# EAGLE design circuit-main (EAGLE 7.5.0)
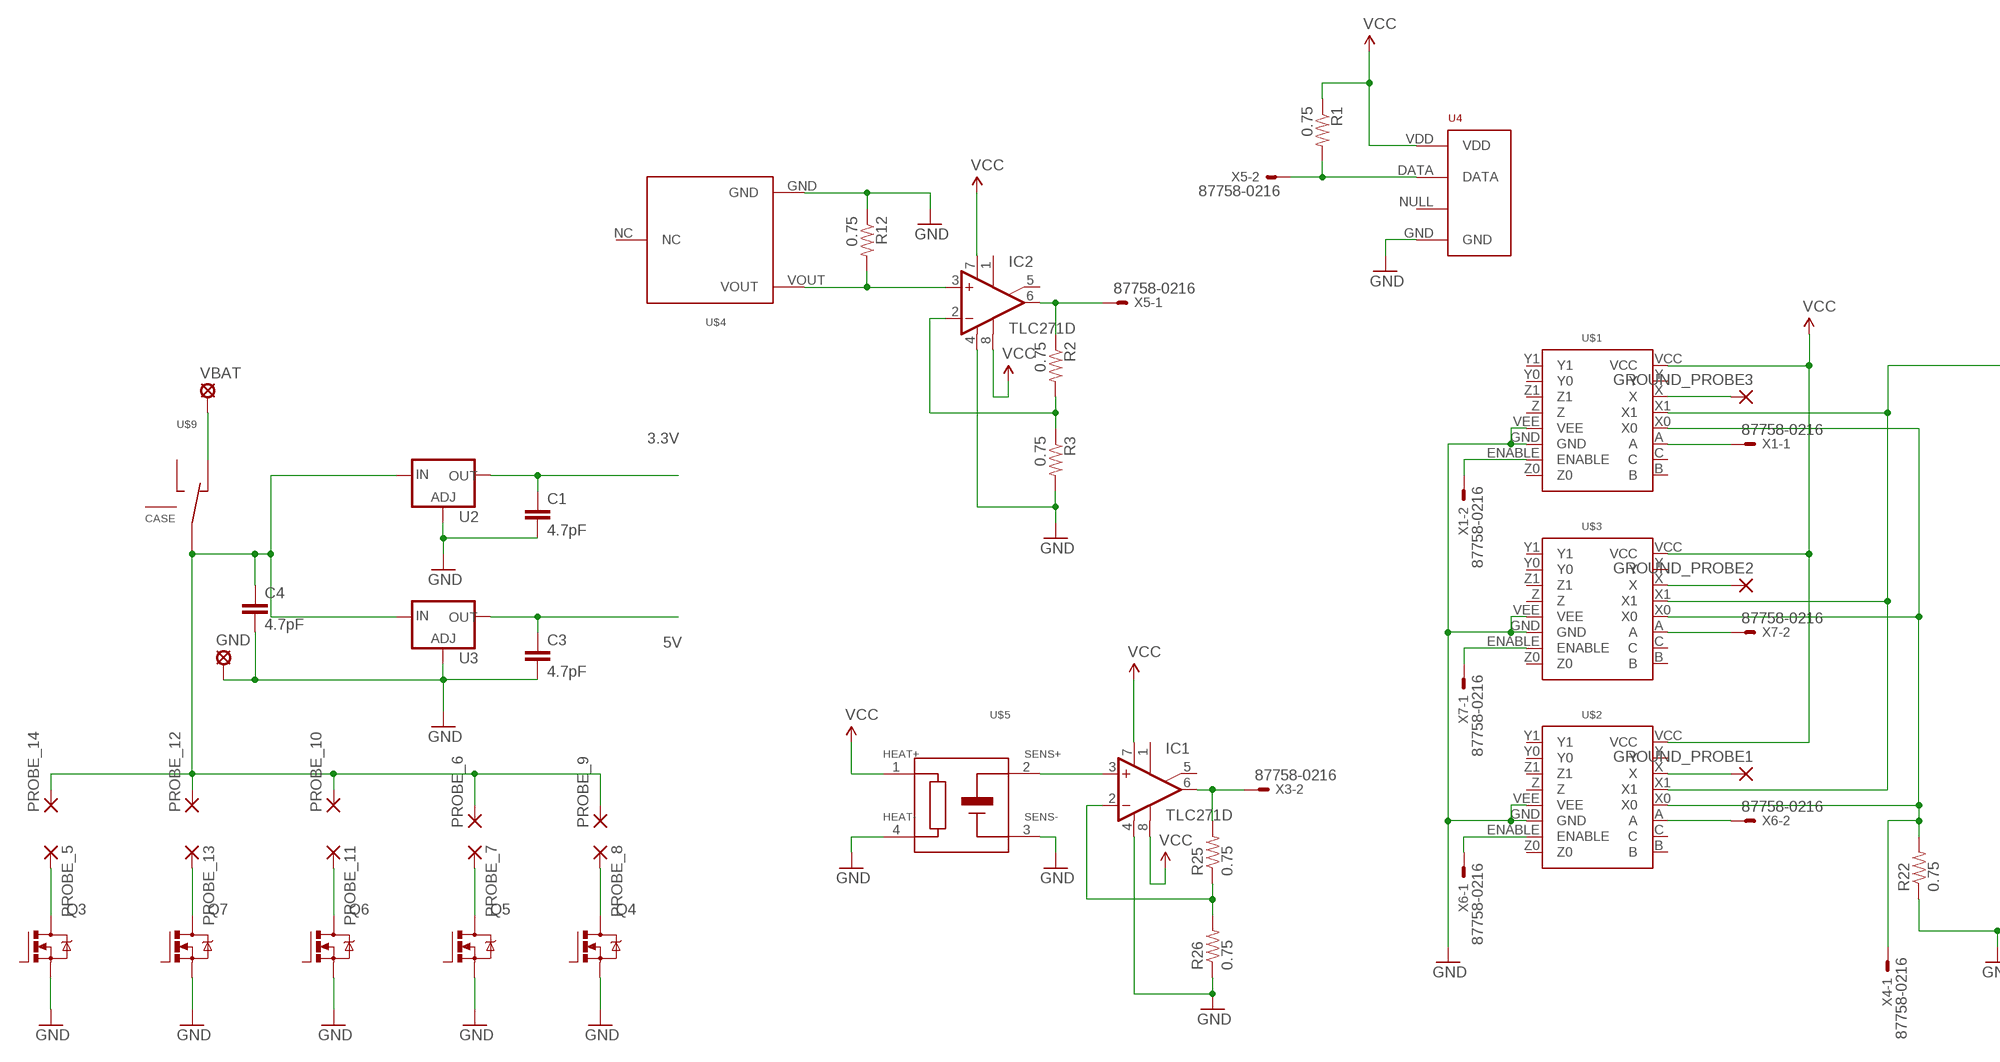
[diagram p0: schematic, sheet 1, part 1 of 2]
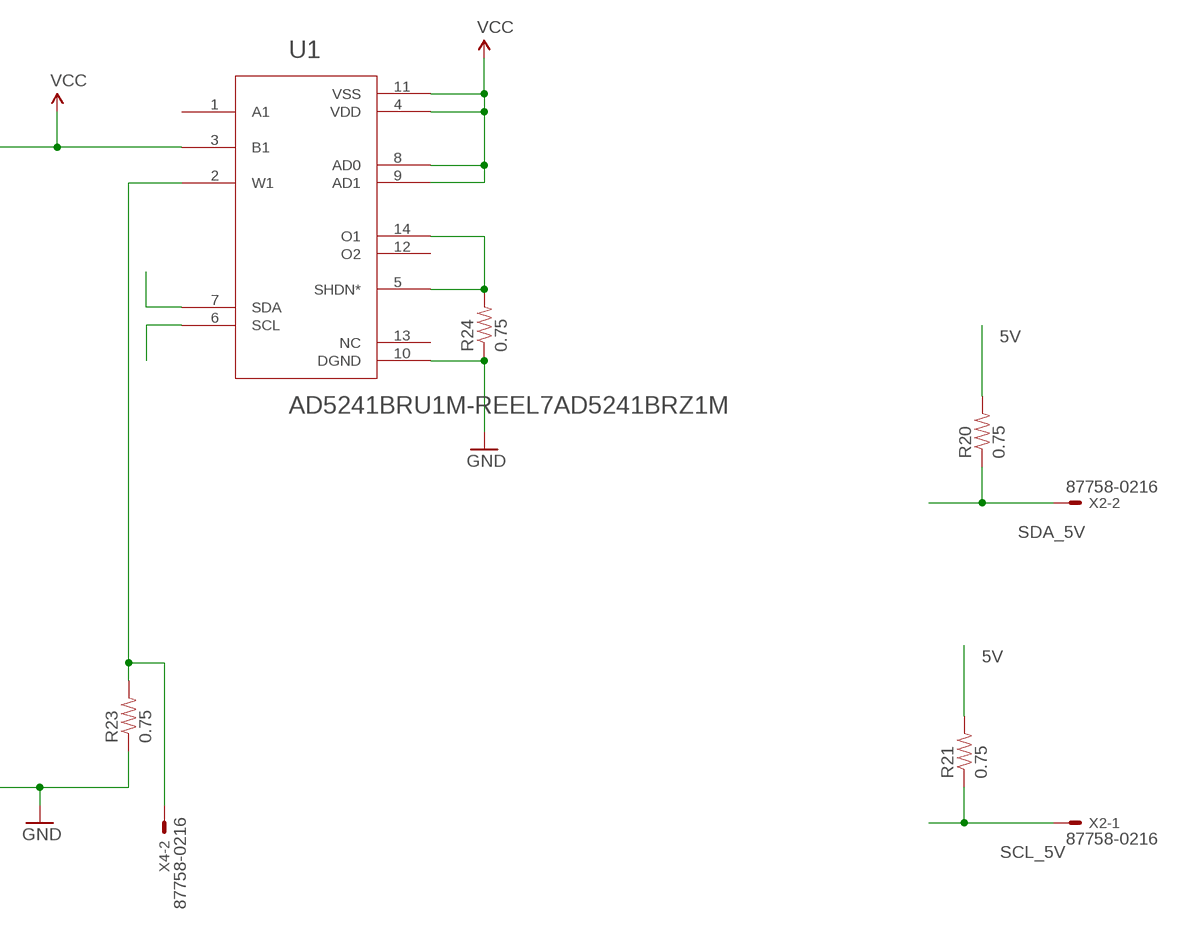
[diagram p1: schematic, sheet 1, part 2 of 2]

## Parts
C1  4.7pF  4.7PF-50V(-/+.25PF)(0603)  [0603-CAP]
C3  4.7pF  4.7PF-50V(-/+.25PF)(0603)  [0603-CAP]
C4  4.7pF  4.7PF-50V(-/+.25PF)(0603)  [0603-CAP]
GND  LSP10  [LSP10]
GROUND_PROBE1  2,54/0,8  [2,54/0,8]
GROUND_PROBE2  2,54/0,8  [2,54/0,8]
GROUND_PROBE3  2,54/0,8  [2,54/0,8]
IC1  TLC271D  [SO08]
IC2  TLC271D  [SO08]
PROBE_5  2,54/0,8  [2,54/0,8]
PROBE_6  2,54/0,8  [2,54/0,8]
PROBE_7  2,54/0,8  [2,54/0,8]
PROBE_8  2,54/0,8  [2,54/0,8]
PROBE_9  2,54/0,8  [2,54/0,8]
PROBE_10  2,54/0,8  [2,54/0,8]
PROBE_11  2,54/0,8  [2,54/0,8]
PROBE_12  2,54/0,8  [2,54/0,8]
PROBE_13  2,54/0,8  [2,54/0,8]
PROBE_14  2,54/0,8  [2,54/0,8]
Q3  NTR4501N  [SOT-23]
Q4  NTR4501N  [SOT-23]
Q5  NTR4501N  [SOT-23]
Q6  NTR4501N  [SOT-23]
Q7  NTR4501N  [SOT-23]
R1  0.75  0.75OHM-1/4W-1%(0805)  [0805]
R2  0.75  0.75OHM-1/4W-1%(0805)  [0805]
R3  0.75  0.75OHM-1/4W-1%(0805)  [0805]
R12  0.75  0.75OHM-1/4W-1%(0805)  [0805]
R20  0.75  0.75OHM-1/4W-1%(0805)  [0805]
R21  0.75  0.75OHM-1/4W-1%(0805)  [0805]
R22  0.75  0.75OHM-1/4W-1%(0805)  [0805]
R23  0.75  0.75OHM-1/4W-1%(0805)  [0805]
R24  0.75  0.75OHM-1/4W-1%(0805)  [0805]
R25  0.75  0.75OHM-1/4W-1%(0805)  [0805]
R26  0.75  0.75OHM-1/4W-1%(0805)  [0805]
U1  AD5241BRU1M-REEL7AD5241BRZ1M  [SOIC-14]
U2  TLV1117-33  [SOT223]
U3  LD1117S50  [SOT223]
U4  RHT03_DHT-22_AM2302RA  [RHT03_DHT-22/RA]
U$1  MC74HC4051A  [SOIC16]
U$2  MC74HC4051A  [SOIC16]
U$3  MC74HC4051A  [SOIC16]
U$4  O2-A2  [O2-A2]
U$5  TGS4161  [TGS4161]
U$9  SS-8  [SS-8]
VBAT  LSP10  [LSP10]
X1  87758-0216  [87758-0216]
X2  87758-0216  [87758-0216]
X3  87758-0216  [87758-0216]
X4  87758-0216  [87758-0216]
X5  87758-0216  [87758-0216]
X6  87758-0216  [87758-0216]
X7  87758-0216  [87758-0216]

## Nets
3.3V: C1.1 R1.1 U2.2(OUT) U2.4(OUT) U4.VDD ; supply symbol labelled VCC
5V: C3.1 IC1.7(V+) IC1.8(OPT) IC2.7(V+) IC2.8(OPT) R20.2 R21.2 U1.3(B1) U1.4(VDD) U1.8(AD0) U1.9(AD1) U1.11(VSS) U3.2(OUT) U3.4(OUT) U$1.VCC U$1.X1 U$2.VCC U$2.X1 U$3.VCC U$3.X1 U$5.1(HEAT+) ; supply symbol labelled VCC
GND: C1.2 C3.2 C4.2 GND.MP IC1.4(V-) IC2.4(V-) Q3.2(S) Q4.2(S) Q5.2(S) Q6.2(S) Q7.2(S) R3.2 R12.1 R22.1 R23.1 R24.1 R26.1 U1.10(DGND) U2.1(ADJ) U3.1(ADJ) U4.GND U$1.GND U$1.VEE U$2.GND U$2.VEE U$3.GND U$3.VEE U$4.GND U$5.3(SENS-) U$5.4(HEAT-)
N$1: IC2.6(OUT) R2.1 X5.1
N$2: GROUND_PROBE3.1(P) U$1.X
N$3: R1.2 U4.DATA X5.2
N$4: IC2.2(-IN) R2.2 R3.1
N$5: GROUND_PROBE2.1(P) U$3.X
N$6: GROUND_PROBE1.1(P) U$2.X
N$8: R23.2 U1.2(W1) X4.2
N$9: R22.2 U$1.X0 U$2.X0 U$3.X0 X4.1
N$11: U$3.ENABLE X7.1
N$12: U$3.A X7.2
N$13: U$2.A X6.2
N$14: U$1.A X1.1
N$15: U$1.ENABLE X1.2
N$16: U$2.ENABLE X6.1
N$18: PROBE_5.1(P) Q3.3(D)
N$19: R24.2 U1.5(SHDN*) U1.14(O1)
N$22: IC1.3(+IN) U$5.2(SENS+)
N$23: PROBE_8.1(P) Q4.3(D)
N$24: IC1.6(OUT) R25.2 X3.2
N$27: PROBE_7.1(P) Q5.3(D)
N$29: PROBE_11.1(P) Q6.3(D)
N$30: PROBE_13.1(P) Q7.3(D)
N$33: U$9.P2 VBAT.MP
N$110: IC2.3(+IN) R12.2 U$4.VOUT
N$111: IC1.2(-IN) R25.1 R26.2
SCL_5V: R21.1 U1.6(SCL) X2.1
SDA_5V: R20.1 U1.7(SDA) X2.2
VBAT: C4.1 PROBE_6.1(P) PROBE_9.1(P) PROBE_10.1(P) PROBE_12.1(P) PROBE_14.1(P) U2.3(IN) U3.3(IN) U$9.COM
Unconnected: IC1.1(ON1) IC1.5(ON2) IC2.1(ON1) IC2.5(ON2) Q3.1(G) Q4.1(G) Q5.1(G) Q6.1(G) Q7.1(G) U1.1(A1) U1.12(O2) U1.13(NC) U4.NULL U$1.B U$1.C U$1.Y U$1.Y0 U$1.Y1 U$1.Z U$1.Z0 U$1.Z1 U$2.B U$2.C U$2.Y U$2.Y0 U$2.Y1 U$2.Z U$2.Z0 U$2.Z1 U$3.B U$3.C U$3.Y U$3.Y0 U$3.Y1 U$3.Z U$3.Z0 U$3.Z1 U$4.NC U$9.CASE_L(CASE) U$9.CASE_R(CASE) U$9.P1 X3.1

## Library data of the parts
C1 C3 C4 = SparkFun-Capacitors:4.7PF-50V(-/+.25PF)(0603): CAP-07880; PROD_ID: CAP-07880
GND VBAT = solpad:LSP10: SOLDER PAD drill 1.0 mm, distributor Buerklin, 12H555
GROUND_PROBE1-GROUND_PROBE3 PROBE_5-PROBE_14 = wirepad:2,54/0,8: THROUGH-HOLE PAD
IC1 IC2 = linear:TLC271: OP AMP
Q3-Q7 = elements:NTR4501N: NTR4501N, NVR4501N Power MOSFET 20 V, 3.2 A, Single N−Channel, SOT−23 http://www.onsemi.ru.com/pub_link/Collateral/NTR4501N-D.PDF
R1-R3 R12 R20-R26 = SparkFun-Resistors:0.75OHM-1/4W-1%(0805): RES-08474; PROD_ID: RES-08474
U1 = elements:AD5241BRU1M-REEL7
U2 = elements:TLV1117-33: Voltage Regulator LM1117 Standard adjustable voltage regulator but in SMD form. Spark Fun Electronics SKU : COM-00595
U3 = elements:LD1117S50: Voltage Regulator LM1117 Standard adjustable voltage regulator but in SMD form. Spark Fun Electronics SKU : COM-00595
U4 = RHT03_DHT-22_AM2302:RHT03_DHT-22_AM2302: RHT03 / DHT-22 / AM2302 Packages and symbol for the RHT03 / DHT-22 relative humidity and temperature sensor. Note: The AM2302 is a wired version of the DHT-22 which typically requires less clearance and is thus provided as a separate package.; PROD_ID: SEN-10167
U$1-U$3 = elements:MC74HC4051A
U$4 = datchiki:O2-A2: O2-A2 Oxy O2-A2 Oxygen Sensor en Sensor http://www.alphasense.com/WEB1213/wp-content/uploads/2015/09/O2A2.pdf
U$5 = datchiki:TGS4161: TGS4161 The Figaro TGS4161 is a new solid electrolyte type sensor which offers miniaturization, low power consumption, and long life. The TGS4161 displays high selectivity to carbon dioxide. Also, the TGS4161 displays good long term stability and shows excellent durability against the effects of high humidity through the application of innovative technology in the sensor’s electrode design. http://www.netzmafia.de/skripten/hardware/Datenblaetter/Gassensoren/TGS4161Dtl.pdf
U$9 = elements:SS-8: SS-8 Наименование: Переключатель мини 3 конт. прям. уг.тип 8 Производитель: Тайвань (Китай) http://www.brownbear.ru/components/ss-8.html
X1-X7 = con-molex:87758-0216: 2 Pin - 2mm Dual Row Single Wafer, Vertical T/H HDR Source: http://www.molex.com/pdm_docs/sd/877580616_sd.pdf; MPN: 87758-0216; OC_FARNELL: unknown; OC_NEWARK: 94M1513

## Board
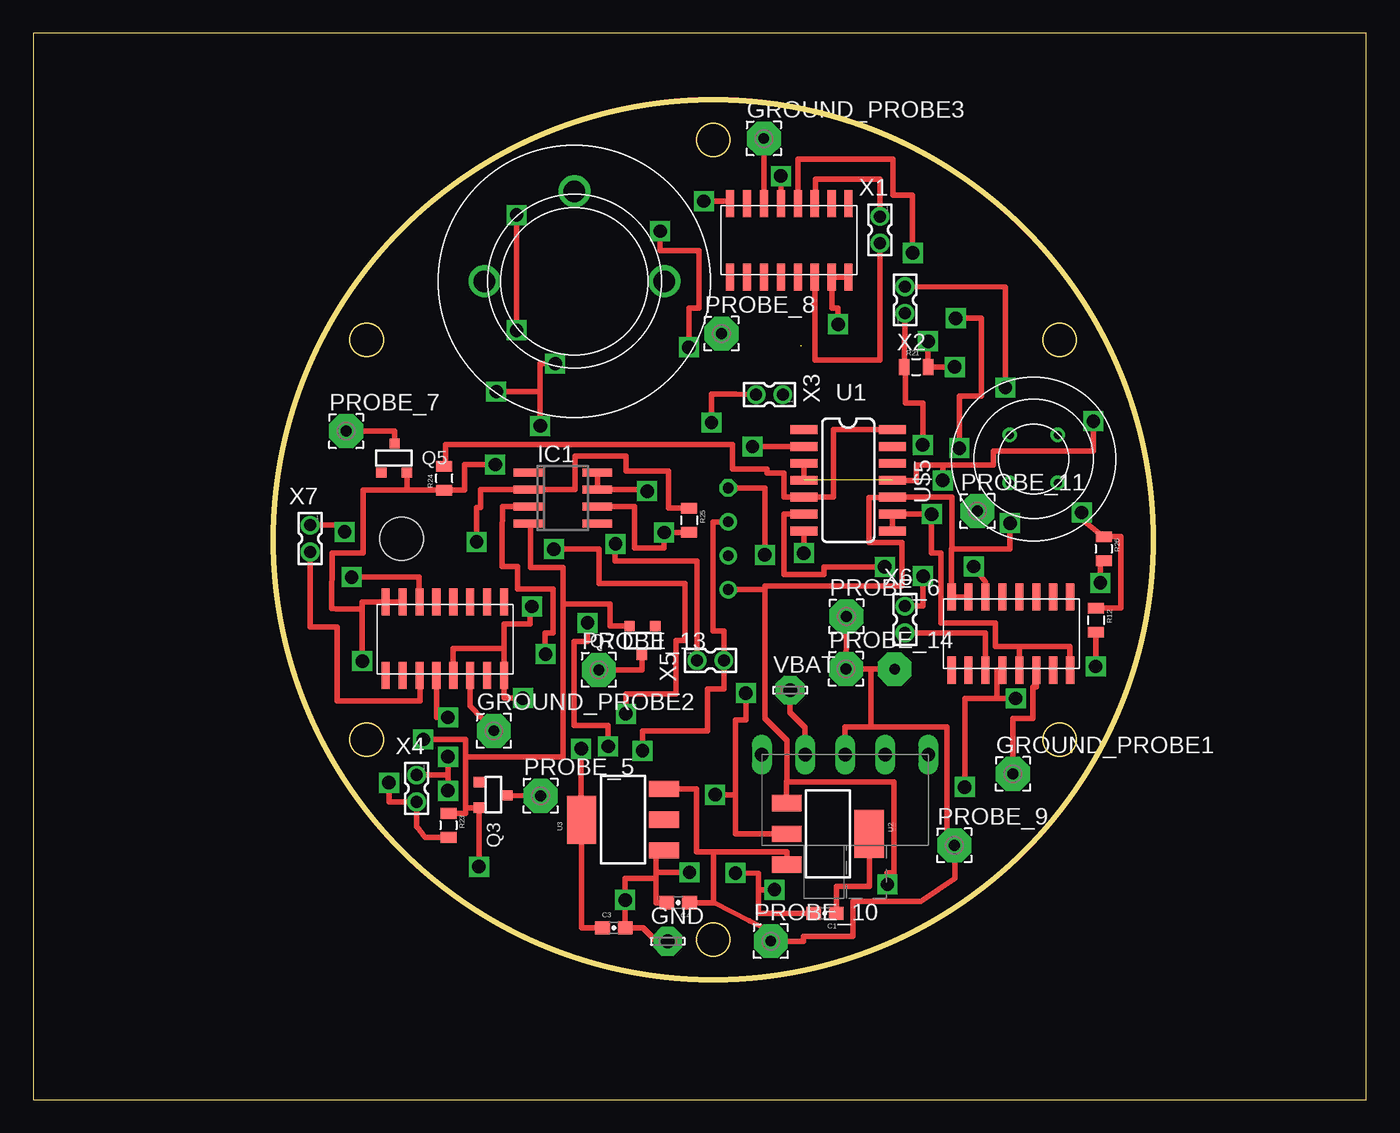
[diagram p2: board, top side]
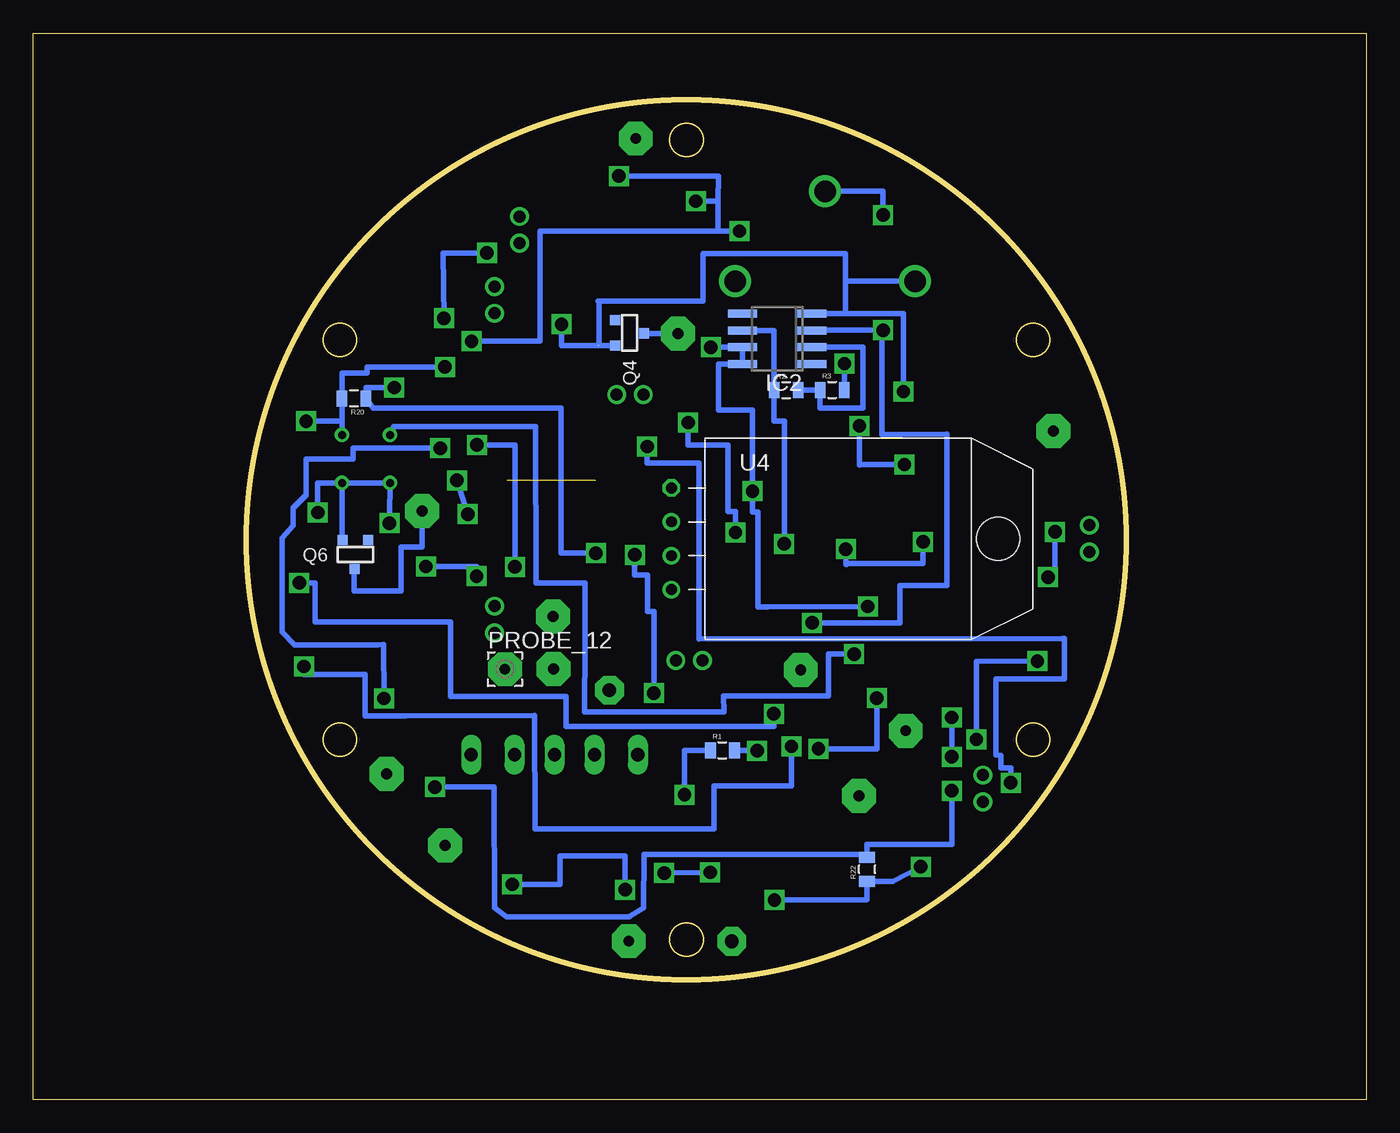
[diagram p3: board, bottom side, seen from below]

Size 100 x 80 mm. Coordinates in mm from the lower left corner, seen from the top.
Outline: 0,0 100,0 100,80 0,80 0,0
Outline: circle at 51,42 radius 33
Outline: circle at 25,27 radius 1.25
Outline: circle at 77,27 radius 1.25
Outline: circle at 51,72 radius 1.25
Outline: circle at 25,57 radius 1.25
Outline: circle at 77,57 radius 1.25
Outline: circle at 51,12 radius 1.25
Copper layers (1*16): Top 0.035mm / dielectric 1.5mm / Bottom 0.035mm
Design rules "default": minimum track width 10mil, minimum drill 24mil, track to track 8mil, track to pad 8mil, pad to pad 8mil, via to via 8mil, smd to smd 8mil, copper to edge 40mil, drill to drill 8mil, minimum pad ring 10mil, minimum via ring 8mil, stop-mask expansion 4mil, vias tented up to drill 0mil, thermal gap 10mil

### Footprints (pad centres in the part's own frame; a part is rotated, then mirrored left to right if it is on the bottom)
0603-CAP = smd 1.1 x 1: 1 -0.85,0; 2 0.85,0
LSP10 = drill 1.016 pad 2.159 octagon: MP 0,0
2,54/0,8 = drill 0.813 pad 2.54 octagon: 1 0,0
SO08 = smd 0.6 x 2.2: 1 -1.905,-2.6; 2 -0.635,-2.6; 3 0.635,-2.6; 4 1.905,-2.6; 5 1.905,2.6; 6 0.635,2.6; 7 -0.635,2.6; 8 -1.905,2.6
SOT-23 = smd 0.762 x 0.762: 1 -0.979,-1.101; 2 0.94,-1.101; 3 0.025,1.067
0805 = smd 0.8 x 1.2: 1 -0.9,0; 2 0.9,0
SOIC-14 = smd 0.66 x 2.032: 1 -4.445,-3.315; 2 -3.175,-3.315; 3 -1.905,-3.315; 4 -0.635,-3.315; 5 0.635,-3.315; 6 1.905,-3.315; 7 3.175,-3.315; 8 3.175,3.315; 9 1.905,3.315; 10 0.635,3.315; 11 -0.635,3.315; 12 -1.905,3.315; 13 -3.175,3.315; 14 -4.445,3.315
SOT223 = smd 1.219 x 2.235: 1 -2.311,-3.099; 2 0,-3.099; 3 2.311,-3.099 | smd 3.6 x 2.2: 4 0,3.099
RHT03_DHT-22/RA = drill 0.8: DATA -1.27,0; GND 3.81,0; NULL 1.27,0 | drill 0.8 octagon: VDD -3.81,0 | hole 3.25: 0,24.5
SOIC16 = smd 2.03 x 0.61: A 5.33,3.17; B 5.33,1.9; C 5.33,0.63; ENABLE -0.17,3.17; GND -0.17,0.63; VCC 5.33,9.52; VEE -0.17,1.9; X 5.33,6.98; X0 5.33,4.44; X1 5.33,5.71; Y 5.33,8.25; Y0 -0.17,8.25; Y1 -0.17,9.52; Z -0.17,5.71; Z0 -0.17,4.44; Z1 -0.17,6.98
O2-A2 = drill 1.6: GND 6.75,0; NC -6.75,0; VOUT 0,-6.75
TGS4161 = drill 0.6: 1 1.8,-1.8; 2 1.8,1.8; 3 -1.8,1.8; 4 -1.8,-1.8
SS-8 = drill 1 long: CASE_L -6.25,-3.81; CASE_R 6.25,-3.81; COM 0,-3.81; P1 -3,-3.81; P2 3,-3.81
87758-0216 = drill 0.9 pad 1.27: 1 0,-1; 2 0,1

### Placement (x,y rotation side)
C1  59.39,13.97 180 top
C3  43.55,12.88 0 top
C4  48.38,14.77 180 top
GND  47.59,11.87 0 top
GROUND_PROBE1  73.5,24.43 0 top
GROUND_PROBE2  34.55,27.67 0 top
GROUND_PROBE3  54.8,72.11 0 top
IC1  39.72,45.12 270 top
IC2  44.2,57.08 90 bottom
PROBE_5  38.05,22.79 0 top
PROBE_6  61.01,36.24 0 top
PROBE_7  23.47,50.15 0 top
PROBE_8  51.63,57.47 0 top
PROBE_9  69.1,19.07 0 top
PROBE_10  55.33,11.88 0 top
PROBE_11  70.84,44.15 0 top
PROBE_12  64.62,32.29 0 bottom
PROBE_13  42.42,32.24 0 top
PROBE_14  60.97,32.31 0 top
Q3  34.52,22.84 270 top
Q4  55.25,57.51 270 bottom
Q5  27.09,48.15 0 top
Q6  75.86,40.88 180 bottom
Q7  45.68,34.42 180 top
R1  48.3,26.2 0 bottom
R2  43.52,53.23 0 bottom
R3  40.08,53.25 0 bottom
R12  79.72,35.98 270 top
R20  75.95,52.6 180 bottom
R21  66.22,54.98 0 top
R22  37.45,17.27 90 bottom
R23  31.14,20.57 270 top
R24  30.82,46.62 90 top
R25  49.2,43.48 270 top
R26  80.3,41.33 270 top
U1  61.15,45.83 270 top
U2  59.62,19.93 270 top
U3  44.23,21 90 top
U4  52.12,42.08 270 bottom
U$1  61.8,61.88 90 top
U$2  68.27,37.55 270 top
U$3  25.8,37.15 270 top
U$4  40.59,61.4 180 top
U$5  75.05,48.07 90 top
U$9  60.9,22.07 180 top
VBAT  56.77,30.72 0 top
X1  63.52,65.25 180 top
X2  65.4,59.99 0 top
X3  55.23,52.9 90 top
X4  28.76,23.34 180 top
X5  50.8,32.95 270 top
X6  65.39,36.02 180 top
X7  20.77,42.09 180 top

### Tracks (layer width: path | path; a pad name or v marks a point on that pad's centre or on a via)
3.3V  (via drill 1)
  Top 0.406: 61.83,20.61 U2.4 62.72,16 60.24,16 C1.1 | U2.2 52.67,19.93 52.67,22.85 | v51.15,22.88 52.67,22.85 | 52.67,22.85 52.67,28.48 53.45,28.48 v53.45,30.5 | U4.VDD 54.88,45.88 v54.88,40.88
  Bottom 0.406: R1.1 51.15,26.2 v51.15,22.88 | v53.45,30.5 53.45,36.62 53.92,36.62 53.92,39.38 54.9,39.38 54.9,40.88 v54.88,40.88
5V  (via drill 1)  (1 unrouted)
  Top 0.406: U1.3 U1.4 | U1.8 U1.9 v67.4,43.92 67.38,43.92 67.38,41 68.08,41 68.08,35.75 72.17,35.75 72.17,34 73.97,34 | 56.08,67.21 U$1.X1 | U$1.X1 | 52.25,67.21 U$1.VCC 52.11,67.38 arc90 52.09,67.4 v50.3,67.4 | v56.08,69.3 56.09,68.92 U$1.X1 | v69.12,54.98 R21.2 v67.12,56.9 | U$2.X1 73.97,34 | 73.97,34 77.75,34 77.75,32.22 U$2.VCC | IC1.8 IC1.7 46.05,45.76 v46.05,45.65 | v37.4,37 37.27,36.83 37.27,35.7 35.3,35.7 35.3,33.85 | U$3.X1 31.51,33.85 35.3,33.85 | 35.3,33.85 35.3,33.15 35.33,33.15 U$3.VCC 35.32,30.12 v36.73,30.12 | v41.1,26.32 41.1,21 U3.4 41.13,12.88 C3.1 | v79.53,50.9 79.53,48.65 72.03,48.65 72.03,47.62 68.22,47.62 | U1.11 66.25,46.45 66.25,47.62 68.22,47.62 | v68.22,46.45 68.22,47.62 | v49.17,56.45 49.17,59.4 49.95,59.4 49.95,63.7 47.02,63.7 v47.02,65.15
  Bottom 0.406: v56.08,69.3 48.6,69.3 48.61,67.43 48.64,67.4 | U$5.1 76.85,50.9 | 76.85,50.9 R20.2 76.85,54.52 74.97,54.52 74.97,54.98 v69.12,54.98 | v67.12,56.9 62,56.9 62,65.15 48.62,65.15 | v50.3,67.4 48.64,67.4 | IC2.8 IC2.7 v49.17,56.44 v49.17,56.45 | v37.4,37 44.92,36.98 45.65,36.95 45.65,44.08 46.05,44.08 v46.05,45.65 46.05,51.73 48.6,51.73 48.6,55.17 IC2.8 | v36.73,30.12 36.73,26.32 v41.1,26.32 | 46.85,55.17 IC2.8 | v79.53,50.9 76.85,50.9 | v67.4,43.92 v68.22,46.45 | v47.02,65.15 48.62,65.15 | 48.64,67.4 48.62,67.4 48.62,65.15
GND  (via drill 1)  (1 unrouted)
  Top 0.406: U$2.VEE U$2.GND 68.89,41.33 68.9,41.33 | U$3.VEE U$3.GND 24.68,37.34 24.68,36.82 | U$1.GND U$1.VEE | GND.MP 46.77,11.88 45.75,12.9 44.42,12.9 C3.2 v44.4,14.97 44.4,16.6 46.73,16.6 | 46.73,16.6 46.73,17.05 | 46.73,17.05 46.73,18.69 U3.1 | C4.2 46.73,14.78 46.73,16.6 | v78.65,44.05 78.65,43.52 R26.1 80.33,42.25 81.6,42.25 81.6,36.88 R12.1 | v49.23,17.05 46.73,17.05 | 32.42,21.88 33.42,21.88 Q3.2 33.42,21.8 v33.42,17.48 | 32.42,25.73 32.42,21.88 | C1.2 58.52,13.97 54.4,13.97 54.4,15.75 | v52.67,17 54.4,16.98 54.4,15.75 | 56.5,23.82 64.58,23.82 64.58,17.02 64.05,17.02 64.05,16.15 v64.08,16.15 | 56.5,23.82 56.5,22.87 U2.1 | 54.4,15.75 v55.6,15.75 | 32.42,25.73 39.75,25.73 39.75,37.17 | 59.85,61.71 U$1.VEE | Q5.2 28.03,45.75 | 28.03,45.75 R24.1 32.35,45.73 32.35,47.65 v34.65,47.65 | v73.28,43.25 73.28,41.33 68.9,41.33 | 68.9,41.33 68.9,45.2 U1.10 64.46,45.17 62.7,45.17 62.7,41.8 65.17,41.8 65.17,38.55 54.88,38.55 54.88,38.27 | 24.68,36.82 22.73,36.82 22.38,36.83 22.4,41.02 24.73,41.02 24.73,45.74 28.03,45.75 | 32.42,21.88 32.42,21.48 R23.1 | v29.25,27.02 32.42,27.02 32.42,25.73 | v24.68,32.9 24.68,36.8 24.68,36.82 | 56.5,23.82 56.5,23.88 56.52,23.88 56.52,26.95 54.88,28.6 54.88,38.27 | IC1.4 37.31,43.22 37.31,39.92 39.75,39.92 39.75,37.17 | v38.02,50.55 38.02,53.12 | 38.02,53.12 38.02,55.23 v39.15,55.23 | 54.88,38.27 U4.GND | v34.73,53.12 38.02,53.12 | U$1.VEE 59.9,59.4 60.38,59.4 v60.38,58.17 | Q7.2 43.25,35.52 43.25,37.17 39.75,37.17
  Bottom 0.406: v44.4,14.97 37.5,14.97 37.45,15.03 R22.1 35.52,16.38 v33.42,17.48 | v78.65,44.05 78.65,46.27 U$5.4 | v52.67,17 49.58,17.05 v49.23,17.05 | U$5.4 U$5.3 73.28,43.83 v73.28,43.25 | Q6.2 76.85,41.95 U$5.4 | v29.25,27.02 29.25,32.88 v24.68,32.9 | 57.55,59.9 49.75,59.9 49.75,63.45 39.08,63.48 39.08,61.4 | 39.08,61.4 39.08,58.98 | v39.15,55.23 39.15,53.25 R3.2 | 39.08,58.98 IC2.4 | Q4.2 57.55,56.57 57.55,59.9 | U$4.GND 39.08,61.4 | 39.08,58.98 34.73,58.98 v34.73,53.12 | 57.65,59.9 57.55,59.9 | 57.64,56.57 60.38,56.57 v60.38,58.17 | v38.02,50.55 38.02,47.65 | v34.65,47.65 38.02,47.65 | 38.02,47.65 38.02,47.62 | v64.08,16.15 60.48,16.15 60.48,18.3 55.6,18.3 v55.6,15.75
N$1  (via drill 1)
  Top 0.406: v43.67,41.7 43.65,40.4 49.8,40.4 X5.1
  Bottom 0.406: IC2.6 44.42,57.71 R2.1 44.42,50.92 43.65,50.92 43.65,41.7 v43.67,41.7
N$2
  Top 0.406: GROUND_PROBE3.1 U$1.X
N$3  (via drill 1)
  Top 0.406: v45.7,26.18 45.7,27.68 50.58,27.68 50.58,30.8 51.8,30.8 X5.2 51.8,35.15 50.98,35.15 50.98,43.34 U4.DATA
  Bottom 0.406: R1.2 45.7,26.2 v45.7,26.18
N$4
  Bottom 0.406: R2.2 40.98,53.23 R3.1 40.98,51.9 37.77,51.9 37.75,56.44 IC2.2
N$5
  Top 0.406: U$3.X 32.78,29.55 GROUND_PROBE2.1
N$6
  Top 0.406: U$2.X 75.25,30.95 75,30.95 75,28.6 73.5,28.6 73.5,27.57 GROUND_PROBE1.1
N$8  (via drill 1)
  Top 0.406: U1.2 55.02,49.01 55.02,49 v53.95,49 | v26.68,23.77 26.68,22.34 X4.2 28.76,20.48 28.77,20.45 29.4,19.68 R23.2 | R23.2
  Bottom 0.406: v26.68,23.77 26.68,24.88 27.43,24.88 27.43,25.82 27.8,25.85 27.8,31.57 22.65,31.55 22.65,34.6 22.75,34.6 50.05,34.58 50.05,47.75 53.98,47.75 v53.95,49
N$9  (via drill 1)
  Top 0.406: X4.1 29.86,24.35 31.1,24.35 | v69.47,48.88 69.47,52.8 71.12,52.8 71.12,58.62 v69.2,58.62 | U$1.X0 57.38,67.21 57.38,70.55 64.47,70.55 64.47,67.85 65.95,67.85 65.95,63.52 v65.97,63.52 | v69.88,23.45 69.88,30.1 72.3,30.1 | 31.1,24.35 v31.1,23.18 | 31.1,24.35 v31.1,25.73 | v31.1,28.68 30.24,28.68 U$3.X0 | v73.7,30.1 72.3,30.1 | U$2.X0 72.3,32.22 72.3,30.1
  Bottom 0.406: v31.1,23.18 31.1,19.15 37.45,19.15 R22.2 37.45,18.4 54.2,18.4 54.22,14.37 55.3,13.72 64.48,13.72 65.4,14.37 65.42,23.48 v69.88,23.45 | v69.47,48.88 76,48.88 76,48.05 79.53,48.05 79.53,45.38 80.5,44.4 80.5,43.08 81.33,42.15 81.33,35.1 80.4,34.12 74.16,34.12 73.7,34.13 v73.7,30.1 | v69.2,58.62 69.25,63.52 v65.97,63.52 | v31.1,25.73 v31.1,28.68
N$11  (via drill 1)
  Top 0.406: U$3.ENABLE 28.95,39.2 v23.88,39.2 | v23.35,42.6 22.68,43.09 X7.1
  Bottom 0.406: v23.88,39.2 23.35,39.2 v23.35,42.6
N$12
  Top 0.406: X7.2 20.77,38.19 20.77,35.48 22.8,35.48 22.8,29.9 29,29.9 29,32.3 U$3.A
N$13
  Top 0.406: 71.55,31.61 U$2.A | 71.5,31.61 U$2.A | U$2.A 71.42,32.22 71.42,35.02 X6.2
N$14
  Top 0.406: U$1.A 58.67,68.08 58.67,69.05 63.52,69.05 63.52,67.28 X1.1
N$15
  Top 0.406: U$1.ENABLE 58.62,55.48 63.52,55.48 63.52,63.51 X1.2
N$16  (via drill 1)
  Top 0.406: U$2.ENABLE 71.44,38.83 v70.55,40 | v66.75,39.27 66.75,37.02 X6.1
  Bottom 0.406: v70.55,40 66.75,40 v66.75,39.27
N$18
  Top 0.406: Q3.3 PROBE_5.1
N$19
  Top 0.406: U1.14 60.02,50.27 60.02,45.2 U1.5 56.33,45.2 56.33,47.02 55.02,47.02 55.02,47.3 52.45,47.3 52.45,49.15 30.93,49.15 30.93,47.52 R24.2
N$22  (via drill 1)
  Top 0.406: 37.12,44.52 IC1.3 35.2,44.49 35.17,42.23 35.17,40 36.33,40 36.33,38.3 39,38.3 39,35 38.4,35 v38.42,33.42
  Bottom 0.406: 73.25,49.83 U$5.2 72.97,50.5 62.33,50.5 62.3,38.75 58.62,38.75 58.62,34.23 58.65,29.07 48.2,29.07 48.23,30.27 40.35,30.27 40.35,33.42 v38.42,33.42
N$23
  Bottom 0.406: Q4.3 51.63,57.48 PROBE_8.1
N$24  (via drill 1)
  Top 0.406: IC1.6 45.1,44.5 45.1,41.4 47.33,41.4 v47.33,42.55 49.2,42.55 R25.2 | v50.88,50.8 50.88,52.92 52.68,52.92 X3.2
  Bottom 0.406: v47.33,42.55 47.33,44.12 47.88,44.12 47.88,49.12 50.88,49.12 v50.88,50.8
N$27
  Top 0.406: Q5.3 27.11,50.15 25.27,50.15 PROBE_7.1
N$29
  Bottom 0.406: 75.89,39.8 Q6.3 75.95,39.81 75.95,38.17 72.4,38.17 72.4,41.45 70.83,41.45 70.83,42.4 PROBE_11.1
N$30
  Top 0.406: PROBE_13.1 45.66,32.24 Q7.3
N$33
  Top 0.406: VBAT.MP 56.77,29.05 57.9,27.93 U$9.P2
N$110  (via drill 1)
  Top 0.406: v36.25,66.38 v36.25,57.73 | R12.2 79.7,35.08 v79.7,32.5 | v43.12,26.5 43.12,28.07 40.58,28.07 40.58,30.4 40.55,30.4 40.55,34.38 41.58,34.38 v41.58,35.77
  Bottom 0.406: U$4.VOUT 36.25,68.14 v36.25,66.38 | IC2.3 41.6,57.73 v36.25,57.73 36.33,57.73 36.33,49.9 34.88,49.9 31.45,49.92 31.45,38.58 34.98,38.58 34.98,35.75 40.52,35.77 v41.58,35.77 | v79.7,32.5 79.7,31.9 75.1,31.9 75.1,28.8 72.1,28.8 | 72.08,28.8 72.1,28.8 | 72.1,28.8 62.4,28.82 62.38,20.32 48.95,20.32 48.95,23.52 43.12,23.52 v43.12,26.5
N$111  (via drill 1)
  Top 0.406: IC1.2 37.12,45.77 | IC1.2 40.65,45.76 40.65,48.27 44.48,48.27 44.48,47.15 47.65,47.15 47.65,44.38 R25.1 | R26.2 80.05,40.42 v80.05,38.77 | IC1.2 33.55,45.76 33.55,44.42 33.25,44.42 v33.25,41.85 | v39.05,41.3 42.42,41.33 42.42,38.73 48.88,38.73 48.88,34.45 48.23,34.45 48.23,30.45 44.45,30.45 v44.45,28.95
  Bottom 0.406: v80.05,38.77 78.88,38.77 78.88,35.83 68.7,35.83 68.7,30.25 60.02,30.25 60.02,28 44.42,28 v44.45,28.95 | v39.05,41.3 39.05,40.15 39,40.15 39,40.23 33.25,40.23 v33.25,41.85
SCL_5V  (via drill 1)
  Top 0.406: X2.1 65.35,55.3 R21.1 65.42,54.98 65.42,52.27 66.72,52.27 v66.72,49.12 | U1.6 56.3,43.92 56.3,39.62 56.3,39.4 59.33,39.4 59.33,39.98 v63.88,39.98
  Bottom 0.406: v66.72,49.12 63.88,49.12 v63.88,39.98
SDA_5V  (via drill 1)
  Top 0.406: v72.92,53.42 72.92,60.97 X2.2 | U1.7 57.8,42.66 v57.8,41
  Bottom 0.406: v72.92,53.42 75.05,53.42 R20.1 74.5,51.88 60.4,51.88 60.4,41.87 60.4,41 v57.8,41
VBAT
  Top 0.406: 51.02,14.77 51.1,14.78 53.73,13.4 55.33,12.63 PROBE_10.1 57.77,11.88 57.77,12.26 61.5,12.26 61.5,14.88 66.58,14.88 69.12,16.6 69.12,17.45 PROBE_9.1 68.55,19.07 68.55,27.95 62.84,27.95 | 51.02,14.77 C4.1 | 62.84,32.29 PROBE_12.1 | 62.84,32.29 PROBE_14.1 61.02,35.17 61.01,35.17 PROBE_6.1 | 62.84,32.29 62.84,27.95 | 62.84,27.95 60.9,27.95 U$9.COM | U2.3 56.52,18.57 51.02,18.57 | U3.3 49.75,23.3 49.75,18.57 51.02,18.57 | 51.02,18.57 51.02,14.77